# Altium project SE-HV00-02.PrjPcb
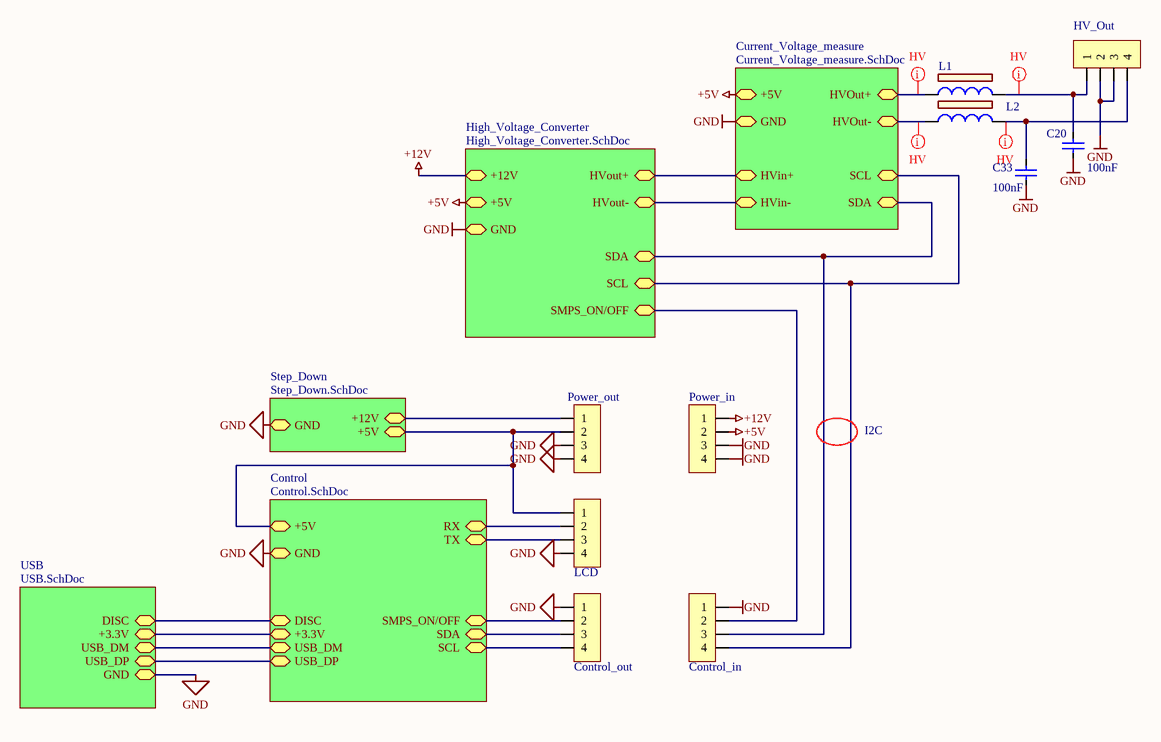
[diagram p0: SE-HV00-02.SchDoc]
6 sheets, 131 parts. Net scope: hierarchical (ports join the sheet entries above them; power ports are global).
Board file: SE-HV00-02.PcbDoc
Sheets:
  SE-HV00-02.SchDoc
    Step_Down = Step_Down.SchDoc
    High_Voltage_Converter = High_Voltage_Converter.SchDoc
    USB = USB.SchDoc
    Control = Control.SchDoc
    Current_Voltage_measure = Current_Voltage_measure.SchDoc

## Sheet SE-HV00-02.SchDoc
size A4

### Parts
C20  100nF  [C1808]
C33  100nF  [C1808]
Control_in  4 Pin Socket  [RA Socket 4 pin]  (value not drawn)
Control_out  HDR 4 Pin  [RA HDR 4Pin]  (value not drawn)
HV_Out  HDR 4  [HDR1X4_3M96V]  (value not drawn)
L1  (no value)  [LL0805\2P]
L2  (no value)  [LL0805\2P]
LCD  B4B-XH-A  [B4B-XH-A]  (value not drawn)
Power_in  4 Pin Socket  [RA Socket 4 pin]  (value not drawn)
Power_out  HDR 4 Pin  [RA HDR 4Pin]  (value not drawn)

### Sub-sheets
Control = Control.SchDoc: +5V, GND, USB_DM, USB_DP, RX, TX, SDA, SCL, DISC, SMPS_ON/OFF, +3.3V
Current_Voltage_measure = Current_Voltage_measure.SchDoc: HVin+, HVin-, SDA, SCL, +5V, GND, HVOut+, HVOut-
High_Voltage_Converter = High_Voltage_Converter.SchDoc: +12V, GND, HVout+, HVout-, SDA, SCL, SMPS_ON/OFF, +5V
Step_Down = Step_Down.SchDoc: +12V, GND, +5V
USB = USB.SchDoc: USB_DP, USB_DM, DISC, +3.3V, GND

### Nets
+3.3V: sheet USB/+3.3V, sheet Control/+3.3V
+5V: Power_in.2 ; sheet High_Voltage_Converter/+5V, sheet Current_Voltage_measure/+5V
+12V: Power_in.1 ; sheet High_Voltage_Converter/+12V
GND: C20.1 C33.1 Control_in.1 Control_out.1 HV_Out.2 HV_Out.3 LCD.4 Power_in.3 Power_in.4 Power_out.3 Power_out.4 ; sheet Step_Down/GND, sheet High_Voltage_Converter/GND, sheet USB/GND, sheet Control/GND, sheet Current_Voltage_measure/GND
NetC9_2: LCD.1 Power_out.2 ; sheet Step_Down/+5V, sheet Control/+5V
NetC12_2: Power_out.1 ; sheet Step_Down/+12V
NetC20_2: C20.2 HV_Out.1 L1.2
NetC33_2: C33.2 HV_Out.4 L2.2
NetC51_2: L1.1 ; sheet Current_Voltage_measure/HVOut+
NetC52_2: L2.1 ; sheet Current_Voltage_measure/HVOut-
NetControl_in_2: Control_in.2 ; sheet High_Voltage_Converter/SMPS_ON/OFF
NetControl_in_3: Control_in.3 ; sheet High_Voltage_Converter/SDA, sheet Current_Voltage_measure/SDA
NetControl_in_4: Control_in.4 ; sheet High_Voltage_Converter/SCL, sheet Current_Voltage_measure/SCL
NetControl_out_2: Control_out.2 ; sheet Control/SMPS_ON/OFF
NetControl_out_3: Control_out.3 ; sheet Control/SDA
NetControl_out_4: Control_out.4 ; sheet Control/SCL
NetD8_2: sheet High_Voltage_Converter/HVout+, sheet Current_Voltage_measure/HVin+
NetD9_1: sheet High_Voltage_Converter/HVout-, sheet Current_Voltage_measure/HVin-
NetLCD_2: LCD.2 ; sheet Control/RX
NetLCD_3: LCD.3 ; sheet Control/TX
NetQ2_1: sheet USB/DISC, sheet Control/DISC
NetR21_2: sheet USB/USB_DM, sheet Control/USB_DM
NetR22_2: sheet USB/USB_DP, sheet Control/USB_DP

### Layout directives
net class HV: NetC20_2, NetC33_2, NetC51_2, NetC52_2

### Notes on the sheet
- I2C

### Library data of the parts
C20 C33 = C0000111: MLCC, X7R, 100NF, 630V, 1808; Manufacturer: KEMET; Manufacturer Part Number: C1808V104KBRACTU; Voltage: 630; Tolerance: ± 10%; Part Number: C0000111; Part Type: MLCC; Material: X7R; Package: C1808; SMD: Yes; Supplier 1: Farnell; Supplier 2: Mouser; Supplier Part Number 2: 2085209; ComponentLink1Description: MFG link
Control_in Power_in = Right angle socket conn 2.54, single row: Right angle socket conn 2.54mm single row
Control_out Power_out = Right angle haeder 2.54 mm single row
HV_Out = J0000151: CONNECTOR, 4 way , HEADER, THT, 3.96MM,10A,250Vac; Manufacturer: JST; Manufacturer Part Number: B4P-VH(LF)(SN); Gender: Male; Project: RALIS; Note: S; Manufacturer Code: *; Notes: *; Aproved: -; Part Number: J0000151; Part Type: Connector\Wire to Board; Pitch: 3.96MM; SMD: No; Supplier 1: Farnell; Supplier Part Number 1: 9492020; Supplier 2: Digi-Key; Supplier Part Number 2: 455-1641-ND; ComponentLink1Description: MFG link; ComponentLink1URL: http://www.jst-mfg.com/product/detail_e.php?series=262; Data: 2014-12-15
L1 L2 = L0000002: BEAD SMD EMI FERRITE 0805 220 OHM; Manufacturer: Murata; Manufacturer Part Number: BLM21PG221SN1D; Resistance: 220 OHM; Part Number: L0000002; Part Type: Ferrite\Bead; SMD: Yes; ComponentLink1Description: MFG link; ComponentLink2Description: DataSheet; Data: 2011-01-26
LCD = J0000086: Wire to Board Header, THT, 2.5MM, 4WAY; Manufacturer: JST; Manufacturer Part Number: B4B-XH-A (LF)(SN); Gender: Pin (Male); Note: S; Manufacturer Code: *; Notes: *; Aproved: -; Part Number: J0000086; Part Type: Connector\Wire to Board; Orientation: Straight PCB PTH; Pitch: 2.5mm; SMD: No; Supplier 1: Farnell; Supplier Part Number 1: 1516278; Supplier 2: Digikey; Supplier Part Number 2: 455-2249-ND; ComponentLink1Description: MFG link; ComponentLink1URL: http://www.farnell.com/datasheets/5448.pdf; Data: 2012-06-06

## Sheet Step_Down.SchDoc
size A4
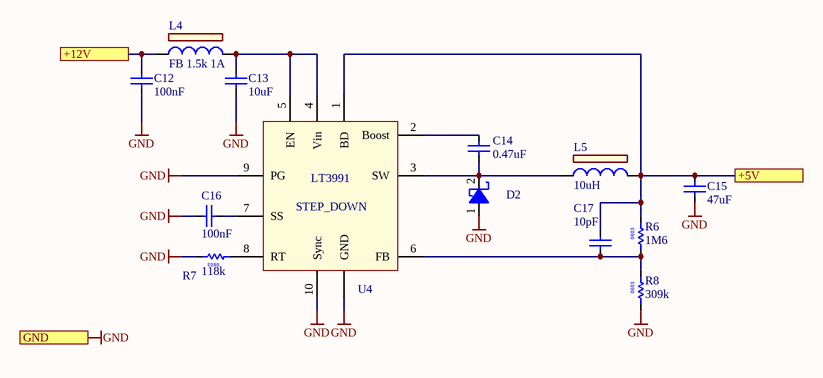
[diagram p1: Step_Down.SchDoc]

### Parts
C12  100nF  [C0603V]
C13  10uF  [CAPC3216N]
C14  0.47uF  [CAPC2012N]
C15  47uF  [CAPC2012N]
C16  100nF  [C0603V]
C17  10pF  [CAPC1608N]
D2  PMEG3010ER  [SOD123]  (value not drawn)
L4  FB 1.5k 1A  [LL0805\2P]
L5  10uH  [L1515]
R6  1M6  [RESC1608N]
R7  118k  [RESC1608X50N]
R8  309k  [RESC1608X50N]
U4  LT3991  [10-LEAD PLASTIC MSOP - duplicate]  (value not drawn)

### Ports
+5V, +12V, GND

### Nets
GND: C12.1 C13.2 C15.1 C16.1 D2.1(ANODE) R7.2 R8.1 U4.9(PG) U4.10(Sync) U4.GND ; port GND
NetC9_2: C15.2 C17.2 L5.2 R6.2 U4.1(BD) ; port +5V
NetC12_2: C12.2 L4.1 ; port +12V
NetC13_1: C13.1 L4.2 U4.4(Vin) U4.5(EN)
NetC14_1: C14.1 D2.2(CATHODE) L5.1 U4.3(SW)
NetC14_2: C14.2 U4.2(Boost)
NetC16_2: C16.2 U4.7(SS)
NetC17_1: C17.1 R6.1 R8.2 U4.6(FB)
NetR7_1: R7.1 U4.8(RT)

### Notes on the sheet
- (in symbol LT3991) STEP_DOWN
- (in symbol R0000563) 0603
- (in symbol R0000610) 0603
- (in symbol R2406149) 0603

### Library data of the parts
C12 C16 = C0000005: MLCC, 0.1uF 16V 10% X7R 0603; Manufacturer: KEMET; Manufacturer Part Number: C0603C104K4RACTU; Voltage: 16; Project: AUT-RX03-00; Note: 0,041 €; Part Number: C0000005; Part Type: MLCC; Tolerance: 10%; Material: X7R; Package: 0603 (1608 metric); SMD: Yes; Supplier 1: Farnell; Supplier Part Number 1: 1414610RL; Supplier 2: Mouser; Supplier Part Number 2: 80-C0603C104K4R; ComponentLink1Description: MFG link; ComponentLink1URL: http://www.kemet.com/datasheets&C0603C104K4RACTU; Data: 2011.02.27
C13 = C0000006: MLCC, 10uF, 16V, 10%, 1206; Manufacturer: MURATA; Manufacturer Part Number: GRM31CR71C106KAC7L; Voltage: 16; Material: X7R; Project: AUT-RX03-00; Note: 1,53 €; Part Number: C0000006; Part Type: MLCC; Tolerance: ±10%; Package: 1206 (3216 metric); SMD: Yes; Supplier 1: Farnell; Supplier Part Number 1: 1845772; Supplier 2: Mouser; Supplier Part Number 2: 81-GRM31CR71C106KAC7; ComponentLink1Description: MFG link; ComponentLink1URL: http://search.murata.co.jp/Ceramy/image/img/PDF/ENG/GRM31CR71C106KAC7.pdf; Data: 2011.02.27
C14 = C0000094: MLCC,0.47uF,50V, 0805,; Manufacturer: MURATA; Manufacturer Part Number: GRM219R60J106KE19D; Voltage: 50; Tolerance: ±10%; Material: X5R; Project: FPGA system; Note: S; Part Number: C0000094; Part Type: MLCC; Package: 0805 (2012 metric); SMD: Yes; Supplier 1: Farnell; Supplier Part Number 1: 1845738; ComponentLink1Description: MFG link; Data: 2013.04.12
C15 = C0000094: MLCC,47uF,50V, 0805,; Manufacturer: MURATA; Manufacturer Part Number: GRM219R60J106KE19D; Voltage: 50; Tolerance: ±10%; Material: X5R; Project: FPGA system; Note: S; Part Number: C0000094; Part Type: MLCC; Package: 0805 (2012 metric); SMD: Yes; Supplier 1: Farnell; Supplier Part Number 1: 1845738; ComponentLink1Description: MFG link; Data: 2013.04.12
C17 = C0000042: MLCC, 0603, NP0, 50V, 10PF; Manufacturer: MULTICOMP; Manufacturer Part Number: MCCA000192; Voltage: 100; Material: C0G / NP0; Project: Zhilinskas_I/II/III; Part Number: C0000042; Part Type: MLCC; Package: 0603 (1608 metric); SMD: Yes; Supplier 1: Farnell; Supplier Part Number 1: 1759053; Price: 0,02; MOQ: 100; Supplier 2: Mouser; Supplier Part Number 2: 77-VJ0603A100JXACBC; ComponentLink1Description: MFG link; ComponentLink1URL: http://www.farnell.com/datasheets/654515.pdf; Data: 2011.06.12
D2 = D0000058: 1A, 30V; Manufacturer: NXP; Vforvard: 360mV; Capacitance: 170pF; Part Number: D0000058; Part Type: Diode\Schottky; Reverse Voltage: 30V; Current: 1A; SMD: Yes; Manufacturer Part Number: PMEG3010ER; ComponentLink1Description: MFG link; ComponentLink1URL: http://www.nxp.com/documents/data_sheet/PMEG3010EP.pdf; Data: 2012.06.20; Supplier 1: SAMPLE
L4 = L0000004: BEAD FERRITE, SMD 1500OHM, 0805; Manufacturer: Wurth Elektronik; Manufacturer Part Number: 742792097; Resistance: 1500; Project: PSP500; Part Number: L0000004; Part Type: Ferrite\Bead; SMD: Yes; Supplier 1: Farnell; Supplier Part Number 1: 1635738; Supplier 2: Mouser; Supplier Part Number 2: 710-742792097; ComponentLink1Description: MFG link; ComponentLink1URL: http://katalog.we-online.de/kataloge/eisos/media/pdf/742792097.pdf; ComponentLink2Description: DataSheet; Data: 2011.02.01
L5 = L0000071: INDUCTOR, SMD, 4X4MM, 10UH, 20%; Manufacturer: Murata; Manufacturer Part Number: LQH44PN100MP0L; Resistance: 0.16; Current: 1.17; SRF: 25MHz; Part Number: L0000071; Part Type: Inductor\Power; Isat: 1.17; Tolerance: 20%; SMD: Yes; Supplier 1: Farnell; Supplier Part Number 1: 1782801; ComponentLink1Description: MFG link; ComponentLink2Description: DataSheet; Data: 2012.01.12
R6 = R2406149: 1M6 5% 0603 1/10W; R2408042: R2406149; Part type: Carbon Film; Tolerance: ±5%; Power: 1/10W; Package: 0603 (1608 metric); SMD: Yes; Data: 2011.01.31
R7 = R0000563: Res, 118K, 0603 (1608 metric), ±1%, 100mW, 75V; Manufacturer: PANASONIC; Manufacturer Part Number: ERJ3EKF1183V; R2408042: R0000563; Part type: Thick Film; Tolerance: ±1%; Power: 100mW; Package: 0603 (1608 metric); SMD: Yes; Supplier 1: Farnell; ComponentLink1Description: MFG link; ComponentLink1URL: http://www.farnell.com/datasheets/1678782.pdf; Data: 2015.09.15
R8 = R0000610: Res, 309K, 0603 (1608 metric), ±1%, 100mW, 75V; Manufacturer: PANASONIC; Manufacturer Part Number: ERJ3EKF3093V; R2408042: R0000610; Part type: Thick Film; Tolerance: ±1%; Power: 100mW; Package: 0603 (1608 metric); SMD: Yes; Supplier 1: Farnell; ComponentLink1Description: MFG link; ComponentLink1URL: http://www.farnell.com/datasheets/1678782.pdf; Data: 2015.09.15
U4 = LT3991: 55V, 1.2A Step-Down  Regulator with 2.8µA  Quiescent Current; Supplier 1: Newark; Supplier Part Number 1: 24T2758

## Sheet High_Voltage_Converter.SchDoc
size A4
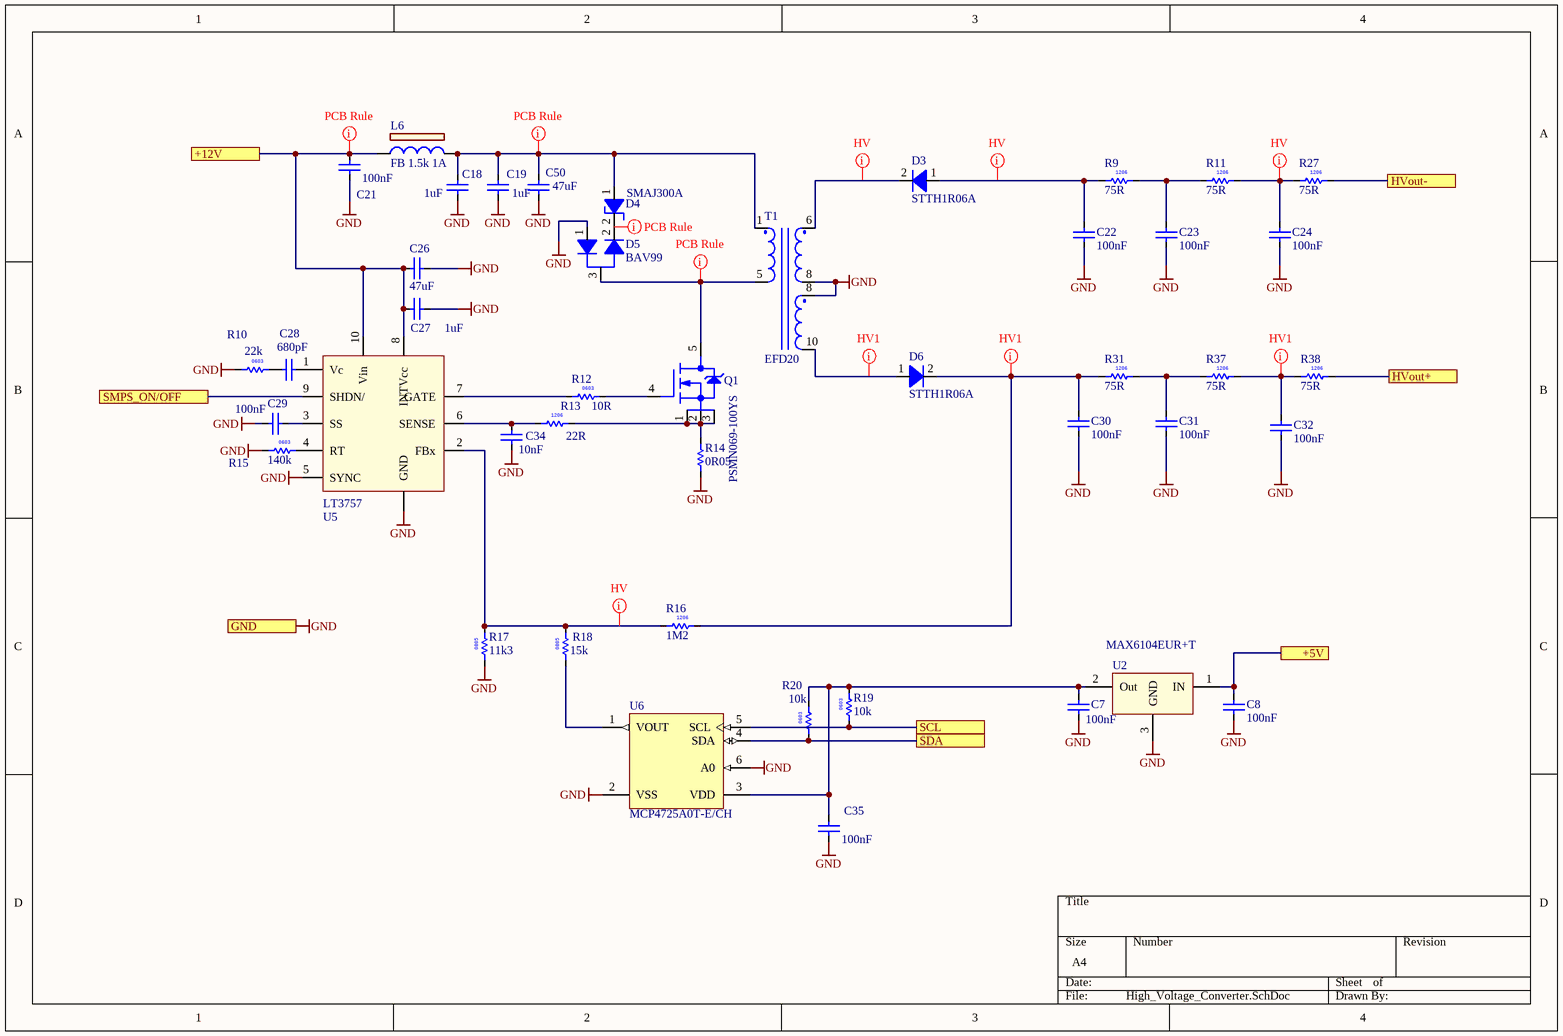
[diagram p2: High_Voltage_Converter.SchDoc]

### Parts
C7  100nF  [C0603V]
C8  100nF  [C0603V]
C18  1uF  [CAPC2012N]
C19  1uF  [CAPC2012N]
C21  100nF  [C0603V]
C22  100nF  [C1808]
C23  100nF  [C1808]
C24  100nF  [C1808]
C26  47uF  [CAPC3225N]
C27  1uF  [CAPC2012N]
C28  680pF  [CAPC3216N]
C29  100nF  [C0603V]
C30  100nF  [C1808]
C31  100nF  [C1808]
C32  100nF  [C1808]
C34  10nF  [CAPC3216N]
C35  100nF  [C0603V]
C50  47uF  [CAPC3225N]
D3  STTH1R06A  [DO-214AC]
D4  SMAJ300A  [DO-214AC]
D5  BAV99  [SOT95P240-3L]
D6  STTH1R06A  [DO-214AC]
L6  FB 1.5k 1A  [LL0805\2P]
Q1  PSMN069-100YS  [SOT669]
R9  75R  [RESC3216N]
R10  22k  [RESC1608X50N]
R11  75R  [RESC3216N]
R12  10R  [RESC1608N]
R13  22R  [RESC3216N]
R14  0R05  [RESC6432AN]
R15  140k  [RESC1608X50N]
R16  1M2  [RESC3216N]
R17  11k3  [RESC2012N]
R18  15k  [RESC2012N]
R19  10k  [RESC1608N]
R20  10k  [RESC1608N]
R27  75R  [RESC3216N]
R31  75R  [RESC3216N]
R37  75R  [RESC3216N]
R38  75R  [RESC3216N]
T1  EFD20  [EFD_20]
U2  MAX6104EUR+T  [SOT23-3]
U5  LT3757  [10-LEAD PLASTIC MSOP - duplicate]
U6  MCP4725A0T-E/CH  [SOT-23-CH6_N]

### Ports
+5V, +12V, GND, HVout+, HVout-, SCL, SDA, SMPS_ON/OFF

### Nets
+5V: C8.2 U2.1(IN) ; port +5V
+12V: C21.2 C26.1 C27.1 L6.1 U5.8(INTVcc) U5.10(Vin) ; port +12V
GND: C7.1 C8.1 C18.2 C19.2 C21.1 C22.1 C23.1 C24.1 C26.2 C27.2 C29.2 C30.1 C31.1 C32.1 C34.1 C35.1 C50.1 D5.1(A1) R10.1 R14.1 R15.1 R17.1 T1.8 U2.3(GND) U5.5(SYNC) U5.GND U6.2(VSS) U6.6(A0) ; port GND
NetC7_2: C7.2 C35.2 R19.2 R20.2 U2.2(Out) U6.3(VDD)
NetC18_1: C18.1 C19.1 C50.2 D4.1(ANODE) L6.2 T1.1
NetC22_2: C22.2 D3.1(anode) R9.1
NetC23_2: C23.2 R9.2 R11.1
NetC24_2: C24.2 R11.2 R27.1
NetC28_1: C28.1 R10.2
NetC28_2: C28.2 U5.1(Vc)
NetC29_1: C29.1 U5.3(SS)
NetC30_2: C30.2 D6.2(cathode) R16.2 R31.1
NetC31_2: C31.2 R31.2 R37.1
NetC32_2: C32.2 R37.2 R38.1
NetC34_2: C34.2 R13.1 U5.6(SENSE)
NetControl_in_2: U5.9(SHDN/) ; port SMPS_ON/OFF
NetControl_in_3: R20.1 U6.4(SDA) ; port SDA
NetControl_in_4: R19.1 U6.5(SCL) ; port SCL
NetD3_2: D3.2(cathode) T1.6
NetD4_2: D4.2(CATHODE) D5.2(A)
NetD5_3: D5.3(K) Q1.5(D) T1.5
NetD6_1: D6.1(anode) T1.10
NetD8_2: R38.2 ; port HVout+
NetD9_1: R27.2 ; port HVout-
NetQ1_1: Q1.1(S) Q1.2(S) Q1.3(S) R13.2 R14.2
NetQ1_4: Q1.4(G) R12.2
NetR12_1: R12.1 U5.7(GATE)
NetR15_2: R15.2 U5.4(RT)
NetR16_1: R16.1 R17.2 R18.2 U5.2(FBx)
NetR18_1: R18.1 U6.1(VOUT)

### Layout directives
net class HV: NetC22_2, NetC24_2, NetD3_2
net class HV1: NetC30_2, NetC32_2, NetD6_1
rule Clearance Constraint [Clearance = 0.5mm]; rule Width Constraint [Pref Width = 2mm    Min Width = 0.5mm    Max Width = 2mm]: +12V, NetC18_1, NetD4_2, NetD5_3
net class HV; rule Clearance Constraint [Clearance = 0.5mm]: NetR16_1

### Notes on the sheet
- (in symbol R0000001) 0603
- (in symbol R0000008) 0603
- (in symbol R0000022) 1206
- (in symbol R0000478) 0603
- (in symbol R0000571) 0603
- (in symbol R2408097) 0805
- (in symbol R2412032) 1206
- (in symbol R2412045) 1206

### Library data of the parts
C7 C8 C21 C29 C35 = C0000005: as C12 on sheet Step_Down; Part Number: C0000005; Part Type: MLCC; Tolerance: 10%; Material: X7R; Package: 0603 (1608 metric); SMD: Yes; Supplier 1: Farnell; Supplier Part Number 1: 1414610RL; Supplier 2: Mouser; Supplier Part Number 2: 80-C0603C104K4R; ComponentLink1Description: MFG link; ComponentLink1URL: http://www.kemet.com/datasheets&C0603C104K4RACTU; Data: 2011.02.27
C18 C19 C27 = C0000037: MLCC, 0805, X5R, 16V, 1UF; Manufacturer: MULTICOMP; Manufacturer Part Number: MCCA000596; Voltage: 16; Tolerance: ±10%; Project: Zhilinskas_I/II/III; Part Number: C0000037; Part Type: MLCC; Material: X5R; Package: 0805 (2012 metric); SMD: Yes; Supplier 1: Farnell; Supplier Part Number 1: 1759479; Price: 0,033; MOQ: 1; Supplier 2: Mouser; Supplier Part Number 2: 77-VJ0805V105ZXJCBC; ComponentLink1Description: MFG link; ComponentLink1URL: http://www.farnell.com/datasheets/462001.pdf; Data: 2011.05.05
C22-C24 C30-C32 = C0000111: as C20 on sheet SE-HV00-02; Part Number: C0000111; Part Type: MLCC; Material: X7R; Package: C1808; SMD: Yes; Supplier 1: Farnell; Supplier 2: Mouser; Supplier Part Number 2: 2085209; ComponentLink1Description: MFG link
C26 C50 = C0000077: MLCC, 1210, 47uF, 16V; Manufacturer: MURATA; Manufacturer Part Number: GRM32ER61C476ME15L; Voltage: 16; Tolerance: ±20%; Material: X5R; Part Number: C0000077; Part Type: MLCC; Package: 1210 (3225 metric); SMD: Yes; Supplier 1: Farnell; Supplier Part Number 1: 1735538; ComponentLink1Description: MFG link; ComponentLink1URL: http://www.farnell.com/datasheets/415303.pdf; Qty: 0; Data: 2012-01-20
C28 = C0000056: MLCC, 680PF, 630V, C0G/NP0, 1206; Manufacturer: MULTICOMP; Manufacturer Part Number: MC1206N681J631CT; Voltage: 630; Tolerance: ±5%; Part Number: C0000056; Part Type: MLCC; Material: C0G / NP0; Package: 1206 (3216 metric); SMD: Yes; Supplier 1: Farnell; Supplier Part Number 1: 1875399; ComponentLink1Description: MFG link; Qty: 5; Data: 2011.07.27
C34 = C0000012: MLCC, 10nF, 630V, ±10% ,X7R, 1206; Manufacturer: TDK; Manufacturer Part Number: C3216X7R2J103M; Voltage: 630; Project: AUT-RX03-00; Note: 0,182 €; Part Number: C0000012; Part Type: MLCC; Tolerance: ±10%; Material: X7R; Package: 1206 (3216 metric); SMD: Yes; Supplier 2: Mouser; Supplier Part Number 2: 810-C3216X7R2J103M; ComponentLink1Description: MFG link; ComponentLink1URL: http://www.tdk.co.jp/tefe02/e413_c.pdf; Data: 2011.02.28
D3 D6 = D0000024: DIODE, fast, 1A, 600V, SMD, SMA; Manufacturer: ST Microelectronics; Vforvard: 1V; Capacitance: 12pF; Part Number: D0000024; Part Type: Diode\Rectifier; Reverse Voltage: 600V; Current: 1A; SMD: Yes; Manufacturer Part Number: STTH1R06A; ComponentLink1Description: MFG link; ComponentLink1URL: http://www.st.com/internet/com/TECHNICAL_RESOURCES/TECHNICAL_LITERATURE/DATASHEET/CD00005135.pdf; ComponentLink2Description: DataSheet; Qty: 5; Data: 2011.06.30; Supplier 1: Farnell; Supplier Part Number 1: 1697520
D4 = D0000021: TVS DIODE, 400W, 300V, DO-214AC; Manufacturer: LITTELFUSE; Part Number: D0000021; Part Type: Diode\TVS\Unidir; Vforvard: 300V; Rating: 400W; SMD: Yes; Manufacturer Part Number: SMAJ300A; ComponentLink1Description: MFG link; ComponentLink1URL: http://www.littelfuse.com/data/en/Data_Sheets/Littelfuse_TVS-Diode_SMAJ.pdf; ComponentLink2Description: DataSheet; Qty: 5; Data: 2011.07.15; Supplier 1: Farnell; Supplier Part Number 1: 1677461; Supplier 2: Mouser; Supplier Part Number 2: 576-SMAJ300A
D5 = D0000001: DIODE SW DUAL 75V 350mW SOT23; Manufacturer Part Number: BAV99-7-F; Vforvard: 1.25V; Current: 2A; Project: AUT-RX03-00; Note: 0,289 €; Part Number: D0000001; Part Type: Diode\Small signal; Reverse Voltage: 75V; Rating: 350mW; SMD: Yes; ComponentLink1Description: MFG link; ComponentLink1URL: http://www.onsemi.com/pub_link/Collateral/BAV99LT1-D.PDF; ComponentLink2Description: DataSheet; Qty: 6000; Data: 2011.02.27; Supplier 1: Farnell; Supplier Part Number 1: 1843683; Supplier 2: Mouser; Supplier Part Number 2: 621-BAV99-F
L6 = L0000004: as L4 on sheet Step_Down; Part Number: L0000004; Part Type: Ferrite\Bead; SMD: Yes; Supplier 1: Farnell; Supplier Part Number 1: 1635738; Supplier 2: Mouser; Supplier Part Number 2: 710-742792097; ComponentLink1Description: MFG link; ComponentLink1URL: http://katalog.we-online.de/kataloge/eisos/media/pdf/742792097.pdf; ComponentLink2Description: DataSheet; Data: 2011.02.01
Q1 = Q0000050: MOSFET 100V, 72.4 mOhm standard level, LFPAK; Manufacturer: NXP; RdsON: 130mΩ; Id: 17A; InputCapacitance: 645pF; Part Number: Q0000050; Part Type: MOSFET\N-CH; Vds: 100V; SMD: Yes; Manufacturer Part Number: PSMN069-100YS; Supplier 1: Farnell; Supplier Part Number 1: 1845662RL; ComponentLink1Description: MFG link; ComponentLink1URL: http://www.nxp.com/documents/data_sheet/PSMN069-100YS.pdf; ComponentLink2Description: Datasheet MFG; Qty: 10; Data: 2012.03.26
R9 R11 R27 R31 R37 R38 = R2412045: 75R 5% 1206 1/4W; R2408042: R2412045; Part type: Carbon Film; Tolerance: ±5%; Power: 1/4W; Package: 1206 (3216 metric); SMD: Yes; Data: 2011-01-31
R10 = R0000478: Res, 22K, 0603 (1608 metric), ±1%, 100mW, 75V; Manufacturer: PANASONIC; Manufacturer Part Number: ERJ3EKF2202V; R2408042: R0000478; Part type: Thick Film; Tolerance: ±1%; Power: 100mW; Package: 0603 (1608 metric); SMD: Yes; Supplier 1: Farnell; ComponentLink1Description: MFG link; ComponentLink1URL: http://www.farnell.com/datasheets/1678782.pdf; Data: 2015.09.15
R12 = R0000001: Res, 0603 0.1W 5%; Manufacturer: PANASONIC; Manufacturer Part Number: ERJ-3GEYJ100V; R2408042: R0000001; Part type: Thick Film; Tolerance: ±5%; Power: 0.1W; Package: 0603 (1608 metric); SMD: Yes; Supplier 1: Farnell; Supplier Part Number 1: 2059548; Supplier 2: Mouser; Supplier Part Number 2: 667-ERJ-3GEYJ100V; ComponentLink1Description: Datasheet MFG; ComponentLink1URL: http://www.panasonic.com/industrial/components/pdf/AOA0000CE1.pdf; Data: 2011.02.27
R13 = R2412032: 22R 5% 1206 1/4W; R2408042: R2412032; Part type: Carbon Film; Tolerance: ±5%; Power: 1/4W; Package: 1206 (3216 metric); SMD: Yes; Data: 2011.01.31
R14 = R2412183: Res, 0.05R 1% 2512 1W; Manufacturer: WELWYN; Manufacturer Part Number: LR2512-R05FW; Note: S; R2408042: R2412183; Part type: Thick Film; Tolerance: ±1%; Power: 1W; Package: 2512 (6431 metric); SMD: Yes; Supplier 1: Farnell; Supplier Part Number 1: 1100065; ComponentLink1Description: MFG link; Qty: 5; Data: 2011.09.22
R15 = R0000571: Res, 140K, 0603 (1608 metric), ±1%, 100mW, 75V; Manufacturer: PANASONIC; Manufacturer Part Number: ERJ3EKF1403V; R2408042: R0000571; Part type: Thick Film; Tolerance: ±1%; Power: 100mW; Package: 0603 (1608 metric); SMD: Yes; Supplier 1: Farnell; ComponentLink1Description: MFG link; ComponentLink1URL: http://www.farnell.com/datasheets/1678782.pdf; Data: 2015.09.15
R16 = R0000022: Res, 1M 0.25W, 1% 1206; Manufacturer: Bourns; Manufacturer Part Number: CR1206-FX-1004ELF; Project: AUT-RX03-00; Note: 0,041 €; R2408042: R0000022; Part type: Thick Film; Tolerance: ±1%; Power: 0.25W; Package: 1206 (3216 metric); SMD: Yes; Supplier 2: Mouser; Supplier Part Number 2: 652-CR1206FX-1004ELF; ComponentLink1Description: Datasheet MFG; ComponentLink1URL: http://www.bourns.com/data/global/pdfs/CHPREZTR.pdf; Data: 2011.03.05
R17 R18 = R2408097: Res, 11K 5% 0805 1/8W; R2408042: R2408097; Part type: Carbon Film; Tolerance: ±5%; Power: 1/8W; Package: 0805 (2012 metric); SMD: Yes; Data: 2011.01.31
R19 R20 = R0000008: Res, 10K 0.063W 75V 1%  0603; Manufacturer: MULTICOMP; Manufacturer Part Number: MCMR06X1002FTL; Project: AUT-RX03-00; Note: 0,033 €; R2408042: R0000008; Part type: Thick Film; Tolerance: ±1%; Power: 0.063W; Package: 0603 (1608 metric); SMD: Yes; Supplier 1: Farnell; Supplier Part Number 1: 2073349; Supplier 2: Mouser; Supplier Part Number 2: 594-MCT06030C1002FP5; ComponentLink1Description: Datasheet MFG; ComponentLink1URL: http://www.vishay.com/doc?28705; Data: 2011.02.28
T1 = EFD_20: Supplier 1: Newark; Supplier Part Number 1: 06W0667
U2 = MAX6104EUR+T: Low-Cost, Micropower, Low-Dropout,  High-Output-Current, SOT23 Voltage References; Supplier 1: Farnell; Supplier Part Number 1: 2511340
U5 = LT3757: Boost, Flyback, SEPIC and  Inverting Controller; Supplier 1: Farnell; Supplier Part Number 1: 2294952
U6 = MCP4725A0T-E/CH: 12-Bit Digital-to-Analog Converter with EEPROM Memory in SOT-23-6, 6-Pin SOT-23, Extended Temperature, Tape and Reel; Published: 29-Jan-2009; LatestRevisionDate: 02-Dec-2009; LatestRevisionNote: Updated to datasheet revision D, Jun-2009; DatasheetVersion: revD, Jun-2009; PackageVersion: revBB, Aug-2009; PackageReference: SOT-23-CH6; Publisher: Altium Limited; PackageDescription: 6-Lead Plastic Small Outline Transistor (CH) [SOT-23]; Supplier 1: Digi-Key; Supplier Part Number 1: MCP4725A0T-E/CHTR-ND; Supplier 2: Digi-Key; Supplier Part Number 2: MCP4725A0T-E/CHCT-ND; Supplier 3: Digi-Key; Supplier Part Number 3: MCP4725A0T-E/CHDKR-ND; Supplier 4: Farnell; Supplier Part Number 4: 1578449; Code_IPC: SOT26A-6; ComponentLink1Description: Datasheet; ComponentLink1URL: http://ww1.microchip.com/downloads/en/DeviceDoc/22039d.pdf; ComponentLink2Description: Packaging Specification; ComponentLink2URL: http://www.microchip.com/stellent/groups/techpub_sg/documents/packagingspec/en012702.pdf; ComponentLink3Description: Microchip.com Home; ComponentLink3URL: http://www.microchip.com/

## Sheet USB.SchDoc
size A4
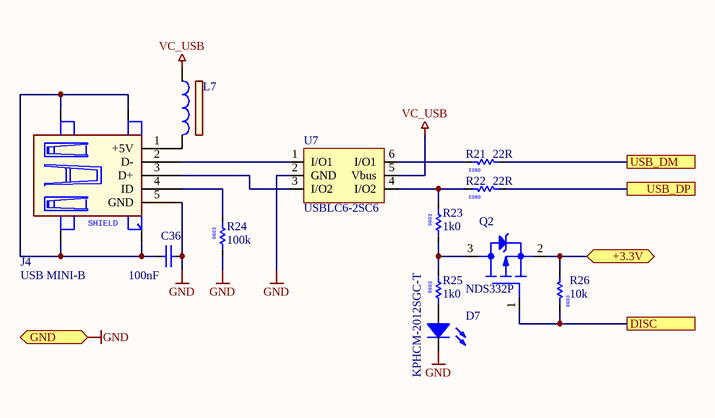
[diagram p3: USB.SchDoc]

### Parts
C36  100nF  [C0603V]
D7  KPHCM-2012SGC-T  [D0805]
J4  USB MINI-B  [MOLEX_MINI_USB-B]
L7  (no value)  [LL0805\2P]
Q2  NDS332P  [SOT23-3L]
R21  22R  [RESC1608N]
R22  22R  [RESC1608N]
R23  1k0  [RESC1608N]
R24  100k  [RESC1608N]
R25  1k0  [RESC1608N]
R26  10k  [RESC1608N]
U7  USBLC6-2SC6  [SOT95P280X145-6N]

### Ports
+3.3V, DISC, GND, USB_DM, USB_DP

### Nets
+3.3V: Q2.2(S) R26.2 ; port +3.3V
GND: C36.1 D7.2 J4.5(GND) R24.1 U7.2(GND) ; port GND
VC_USB: L7.1 U7.5(Vbus)
NetC36_2: C36.2 J4.6(SHIELD) J4.7(SHIELD) J4.8(SHIELD) J4.9(SHIELD)
NetD7_1: D7.1 R25.1
NetJ4_1: J4.1(+5V) L7.2
NetJ4_2: J4.2(D-) U7.1(I/O1)
NetJ4_3: J4.3(D+) U7.3(I/O2)
NetJ4_4: J4.4(ID) R24.2
NetQ2_1: Q2.1(G) R26.1 ; port DISC
NetQ2_3: Q2.3(D) R23.1 R25.2
NetR21_1: R21.1 U7.6(I/O1)
NetR21_2: R21.2 ; port USB_DM
NetR22_1: R22.1 R23.2 U7.4(I/O2)
NetR22_2: R22.2 ; port USB_DP

### Notes on the sheet
- (in symbol R0000006) 0603
- (in symbol R0000008) 0603
- (in symbol R2406032) 0603
- (in symbol R2406120) 0603

### Library data of the parts
C36 = C0000005: as C12 on sheet Step_Down; Part Number: C0000005; Part Type: MLCC; Tolerance: 10%; Material: X7R; Package: 0603 (1608 metric); SMD: Yes; Supplier 1: Farnell; Supplier Part Number 1: 1414610RL; Supplier 2: Mouser; Supplier Part Number 2: 80-C0603C104K4R; ComponentLink1Description: MFG link; ComponentLink1URL: http://www.kemet.com/datasheets&C0603C104K4RACTU; Data: 2011.02.27
D7 = D0000030: LED, SMD, 0805, GREEN, 25mcd; Manufacturer: KINGBRIGHT; Vforvard: 2.5; Current: 20mA; Project: Zhilinskas_I/II/III; Note: S; Part Number: D0000030; Part Type: Diode\LED; Rating: 25 mcd; SMD: Yes; Manufacturer Part Number: KPHCM-2012SGC-T; ComponentLink1Description: MFG link; ComponentLink1URL: http://www.kingbright-europe.de/_daten/KPHCM-2012SGC-T(Ver.3).pdf; ComponentLink2Description: DataSheet; Data: 2011.09.15; Supplier 1: Farnell; Supplier Part Number 1: 1686074; Supplier 2: Mouser; Supplier Part Number 2: 859-LTST-C171CKT
J4 = J0000002: USB MINI-B SMT connector; Manufacturer: Molex; Manufacturer Part Number: 675031020; Gender: Receptacle; 3D Model: SW3dPS-USB_mini_B; Project: PSP500; Part Number: J0000002; Part Type: Connector\USB; Orientation: RA; SMD: Yes; Supplier 1: Farnell; Supplier Part Number 1: 1125348; Price: 5,39; Supplier 2: Mouser; Supplier Part Number 2: 538-67503-1020; ComponentLink1Description: MFG link; ComponentLink1URL: http://www.molex.com/pdm_docs/sd/675031020_sd.pdf; ComponentLink2Description: USB.pdf; ComponentLink2URL: \\193.219.36.50\nescafe\Altium Database\KTU340DB\PDF\Connector\USB\675031020_sd.pdf; Qty: 5; Data: 2011.01.28
L7 = L0000002: as L1 on sheet SE-HV00-02; Part Number: L0000002; Part Type: Ferrite\Bead; SMD: Yes; ComponentLink1Description: MFG link; ComponentLink2Description: DataSheet; Data: 2011-01-26
Q2 = Q0000046: P-Channel Logic Level Enhancement Mode Field Effect Transistor; Manufacturer: FAIRCHILD SEMICONDUCTOR; Vds: -20V; RdsON: 300mΩ; Id: 1A; Part Number: Q0000046; Part Type: MOSFET\P-CH; SMD: Yes; Manufacturer Part Number: NDS332P; Supplier 1: Farnell; Supplier Part Number 1: 1471069; Supplier 2: Mouser; Supplier Part Number 2: 512-NDS332P; ComponentLink1Description: MFG link; ComponentLink1URL: http://www.fairchildsemi.com/ds/ND/NDS332P.pdf; ComponentLink2Description: Datasheet MFG; Qty: 3; Data: 2012.02.20
R21 R22 = R2406032: Res, 22R 5% 0603 1/10W; Manufacturer: MULTICOMP; Manufacturer Part Number: MC0063W0603122R; Supplier 1: Farnell; Supplier Part Number 1: 9330844; Supplier 2: Mouser; Supplier Part Number 2: 660-RK73H1JTTD22R0F; Part type: Carbon Film; Tolerance: ±5%; Power: 1/10W; Package: 0603 (1608 metric); SMD: Yes; Data: 2011.01.31; R2408042: R2406032
R23 R25 = R0000006: Res, thin film 1k  ±5% 0.1W 0603; Manufacturer: MULTICOMP; Manufacturer Part Number: MCMR06X102 JTL; Project: AUT-RX03-00; Note: 0,083 €; R2408042: R0000006; Part type: Thin Film; Tolerance: ±5%; Power: 0.1W; Package: 0603 (1608 metric); SMD: Yes; Supplier 1: Farnell; Supplier Part Number 1: 2073354; Supplier 2: Mouser; Supplier Part Number 2: 71-TNPW06031K00DEEA; ComponentLink1Description: Datasheet MFG; ComponentLink1URL: http://www.vishay.com./doc?28758; Data: 2011.02.28
R24 = R2406120: Res, 100K 5% 0603 1/10W; Manufacturer: YAGEO; Manufacturer Part Number: RC0603FR-13100KL; Tolerance: ±1%; R2408042: R2406120; Part type: Carbon Film; Power: 1/10W; Package: 0603 (1608 metric); SMD: Yes; Supplier 1: Farnell; Supplier Part Number 1: 2309107; Supplier 2: Mouser; Supplier Part Number 2: 603-RC0603FR-13100KL; Data: 2011.01.31
R26 = R0000008: as R19 on sheet High_Voltage_Converter; R2408042: R0000008; Part type: Thick Film; Tolerance: ±1%; Power: 0.063W; Package: 0603 (1608 metric); SMD: Yes; Supplier 1: Farnell; Supplier Part Number 1: 2073349; Supplier 2: Mouser; Supplier Part Number 2: 594-MCT06030C1002FP5; ComponentLink1Description: Datasheet MFG; ComponentLink1URL: http://www.vishay.com/doc?28705; Data: 2011.02.28
U7 = D0000115: DIODE ARRAY, TVS, USB2; Manufacturer: STMICROELECTRONICS; Part Number: D0000115; Part Type: Diode\TVS; SMD: Yes; Manufacturer Part Number: USBLC6-2SC6; ComponentLink1Description: MFG link; ComponentLink1URL: http://www.farnell.com/datasheets/1690354.pdf; Data: 2016.03.08; Supplier 1: Farnell; Supplier Part Number 1: 1269406

## Sheet Control.SchDoc
size A4
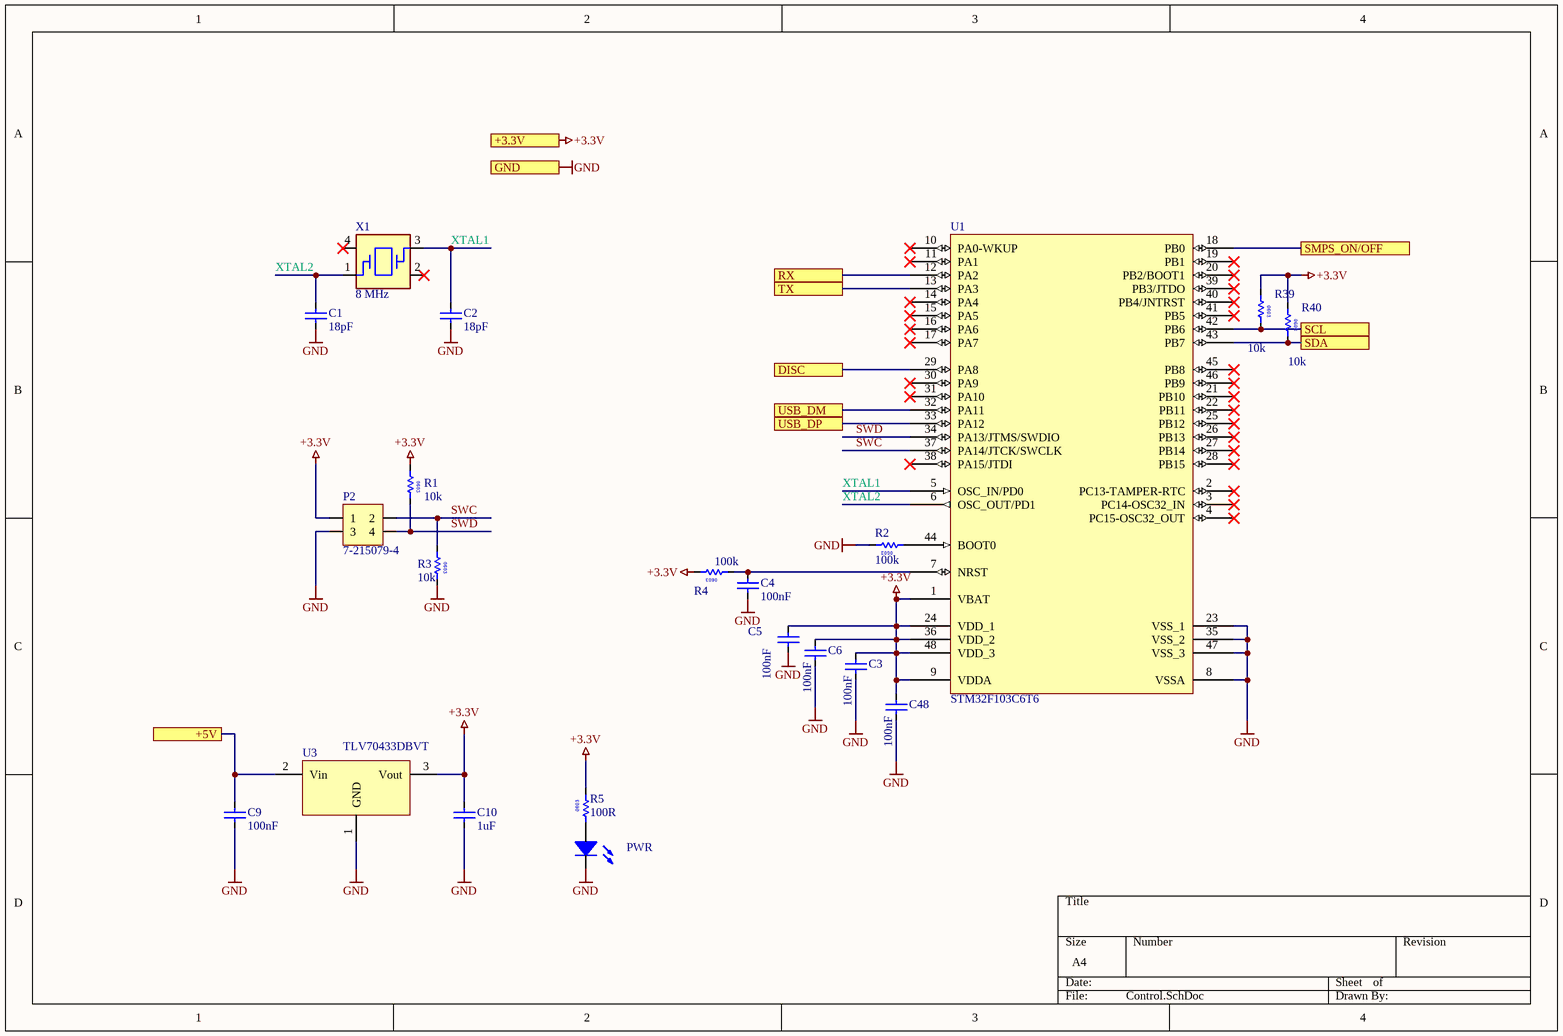
[diagram p4: Control.SchDoc]

### Parts
C1  18pF  [CAPC1608N]
C2  18pF  [CAPC1608N]
C3  100nF  [C0603V]
C4  100nF  [C0603V]
C5  100nF  [C0603V]
C6  100nF  [C0603V]
C9  100nF  [C0603V]
C10  1uF  [CAPC2012N]
C48  100nF  [C0603V]
P2  7-215079-4  [ZIP-T4]
PWR  KPHCM-2012SGC-T  [D0805]  (value not drawn)
R1  10k  [RESC1608N]
R2  100k  [RESC1608N]
R3  10k  [RESC1608N]
R4  100k  [RESC1608N]
R5  100R  [RESC1608N]
R39  10k  [RESC1608N]
R40  10k  [RESC1608N]
U1  STM32F103C6T6  [LQFP48_N]
U3  TLV70433DBVT  [SO-G5/P.95]
X1  8 MHz  [2SMX-3SMXB]

### Ports
+3.3V, +5V, DISC, GND, RX, SCL, SDA, SMPS_ON/OFF, TX, USB_DM, USB_DP

### Nets
+3.3V: C3.2 C5.2 C6.2 C10.2 C48.2 P2.1 R1.1 R4.2 R5.2 R39.1 R40.1 U1.1(VBAT) U1.9(VDDA) U1.24(VDD_1) U1.36(VDD_2) U1.48(VDD_3) U3.3(Vout) ; port +3.3V
GND: C1.1 C2.1 C3.1 C4.1 C5.1 C6.1 C9.1 C10.1 C48.1 P2.3 PWR.2 R2.2 R3.2 U1.8(VSSA) U1.23(VSS_1) U1.35(VSS_2) U1.47(VSS_3) U3.1(GND) ; port GND
SWC: P2.2 R3.1 U1.37(PA14/JTCK/SWCLK)
SWD: P2.4 R1.2 U1.34(PA13/JTMS/SWDIO)
XTAL1: C2.2 U1.5(OSC_IN/PD0) X1.3
XTAL2: C1.2 U1.6(OSC_OUT/PD1) X1.1
NetC4_2: C4.2 R4.1 U1.7(NRST)
NetC9_2: C9.2 U3.2(Vin) ; port +5V
NetControl_out_2: U1.18(PB0) ; port SMPS_ON/OFF
NetControl_out_3: R40.2 U1.43(PB7) ; port SDA
NetControl_out_4: R39.2 U1.42(PB6) ; port SCL
NetLCD_2: U1.12(PA2) ; port RX
NetLCD_3: U1.13(PA3) ; port TX
NetPWR_1: PWR.1 R5.1
NetQ2_1: U1.29(PA8) ; port DISC
NetR2_1: R2.1 U1.44(BOOT0)
NetR21_2: U1.32(PA11) ; port USB_DM
NetR22_2: U1.33(PA12) ; port USB_DP

Not connected (* = marked no-connect by the designer): U1 2(PC13-TAMPER-RTC)* 3(PC14-OSC32_IN)* 4(PC15-OSC32_OUT)* 10(PA0-WKUP)* 11(PA1)* 14(PA4)* 15(PA5)* 16(PA6)* 17(PA7)* 19(PB1)* 20(PB2/BOOT1)* 21(PB10)* 22(PB11)* 25(PB12)* 26(PB13)* 27(PB14)* 28(PB15)* 30(PA9)* 31(PA10)* 38(PA15/JTDI)* 39(PB3/JTDO)* 40(PB4/JNTRST)* 41(PB5)* 45(PB8)* 46(PB9)*; X1 2* 4*

### Notes on the sheet
- (in symbol R0000008) 0603
- (in symbol R2406048) 0603
- (in symbol R2406120) 0603

### Library data of the parts
C1 C2 = C0000124: MLCC, 18 pF, ± 5%, C0G / NP0, 50 V, 0603; Manufacturer: MULTICOMP; Manufacturer Part Number: MC0603N180J500CT; Voltage: 50; Part Number: C0000124; Part Type: MLCC; Tolerance: ±5%; Material: C0G / NP0; Package: 0603 (1608 metric); SMD: Yes; Supplier 1: Farnell; Supplier Part Number 1: 1759056; ComponentLink1Description: MFG link; ComponentLink1URL: http://www.farnell.com/datasheets/1901289.pdf; Data: 2016.03.08
C3-C6 C9 C48 = C0000005: as C12 on sheet Step_Down; Part Number: C0000005; Part Type: MLCC; Tolerance: 10%; Material: X7R; Package: 0603 (1608 metric); SMD: Yes; Supplier 1: Farnell; Supplier Part Number 1: 1414610RL; Supplier 2: Mouser; Supplier Part Number 2: 80-C0603C104K4R; ComponentLink1Description: MFG link; ComponentLink1URL: http://www.kemet.com/datasheets&C0603C104K4RACTU; Data: 2011.02.27
C10 = C0000037: as C18 on sheet High_Voltage_Converter; Part Number: C0000037; Part Type: MLCC; Material: X5R; Package: 0805 (2012 metric); SMD: Yes; Supplier 1: Farnell; Supplier Part Number 1: 1759479; Price: 0,033; MOQ: 1; Supplier 2: Mouser; Supplier Part Number 2: 77-VJ0805V105ZXJCBC; ComponentLink1Description: MFG link; ComponentLink1URL: http://www.farnell.com/datasheets/462001.pdf; Data: 2011.05.05
P2 = J0000107: Micro-match SOCKET, TOP ENTRY, 4WAY PTH, 1.27mm; Manufacturer: TE Connectivity; Gender: Female; Note: S; Manufacturer Code: *; Notes: *; Aproved: -; Part Number: J0000107; Part Type: Connector\MiniHeader; Orientation: Straight; Pitch: 1.27mm; SMD: No; Manufacturer Part Number: 7-215079-4; Supplier 1: Farnell; Supplier Part Number 1: 148507; ComponentLink1Description: MFG link; ComponentLink1URL: http://www.tycoelectronics.com/commerce/DocumentDelivery/DDEController?Action=srchrtrv&DocNm=108-19052&DocType=Specification+Or+Standard&DocLang=English; Data: 2012.12.18
PWR = D0000030: as D7 on sheet USB; Part Number: D0000030; Part Type: Diode\LED; Rating: 25 mcd; SMD: Yes; Manufacturer Part Number: KPHCM-2012SGC-T; ComponentLink1Description: MFG link; ComponentLink1URL: http://www.kingbright-europe.de/_daten/KPHCM-2012SGC-T(Ver.3).pdf; ComponentLink2Description: DataSheet; Data: 2011.09.15; Supplier 1: Farnell; Supplier Part Number 1: 1686074; Supplier 2: Mouser; Supplier Part Number 2: 859-LTST-C171CKT
R1 R3 R39 R40 = R0000008: as R19 on sheet High_Voltage_Converter; R2408042: R0000008; Part type: Thick Film; Tolerance: ±1%; Power: 0.063W; Package: 0603 (1608 metric); SMD: Yes; Supplier 1: Farnell; Supplier Part Number 1: 2073349; Supplier 2: Mouser; Supplier Part Number 2: 594-MCT06030C1002FP5; ComponentLink1Description: Datasheet MFG; ComponentLink1URL: http://www.vishay.com/doc?28705; Data: 2011.02.28
R2 R4 = R2406120: as R24 on sheet USB; R2408042: R2406120; Part type: Carbon Film; Power: 1/10W; Package: 0603 (1608 metric); SMD: Yes; Supplier 1: Farnell; Supplier Part Number 1: 2309107; Supplier 2: Mouser; Supplier Part Number 2: 603-RC0603FR-13100KL; Data: 2011.01.31
R5 = R2406048: Res, 100R 5% 0603 1/10W; Manufacturer: MULTICOMP; Manufacturer Part Number: MC 0.063W 0603 5% 100R; R2408042: R2406048; Part type: MC 0.063W 0603 5% 100R; Tolerance: ±5%; Power: 1/10W; Package: 0603 (1608 metric); SMD: Yes; Supplier 1: Farnell; Supplier Part Number 1: 9331689RL; Data: 2011.01.31
U1 = STM32F103C6T6: STM32 ARM-based 32-bit MCU with 32 Kbytes Flash, 48-pin LQFP, Industrial Temperature; Published: 30-May-2008; DatasheetVersion: rev6, Mar-2008; PackageVersion: Mar-2008; PackageReference: LQFP48; Publisher: Altium Limited; PackageDescription: 48-Pin Low-Profile Quad Flat Pack, 7 x 7 mm Body, 0.5 mm Pitch (LQFP48); ComponentLink1Description: Manufacturer Link; ComponentLink1URL: www.st.com/stm32; ComponentLink2Description: Datasheet; ComponentLink2URL: http://www.st.com/stonline/products/literature/ds/13587.pdf
U3 = U0000415: LDO, 3.3V, 150MA, SOT23-5 Vin - 24V; Manufacturer: Texas Instruments; LibRef: U0000415; SMD: Yes; Manufacturer Part Number: TLV70433DBVT; Supplier 1: Farnell; Supplier Part Number 1: 2075417; ComponentLink1Description: Datasheet MFG; ComponentLink1URL: http://www.farnell.com/datasheets/1634139.pdf; ComponentLink2Description: Manufacturer Page; Data: 2012.07.31
X1 = M0000014: CRYSTAL, 8M, 18PF CL, 6X3.6MM SMT; Manufacturer: ABRACON; Manufacturer Part Number: ABMM2-8.000MHZ-E2-T; Rating: 8MHz; Tolerance: ± 20ppm; Note: 1; Part Number: M0000014; Part Type: Crystals\XTAL; SMD: Yes; Supplier 1: Farnell; Supplier Part Number 1: 1611803; Price: 2,57; MOQ: 1; Supplier 2: Mouser; Supplier Part Number 2: 815-ABMM2-8-E2T; ComponentLink1Description: MFG link; ComponentLink2Description: Datasheet PDF; ComponentLink2URL: http://www.abracon.com/Resonators/ABMM2.pdf; Qty: 7; Data: 2011.02.17

## Sheet Current_Voltage_measure.SchDoc
size 381 x 241 mm
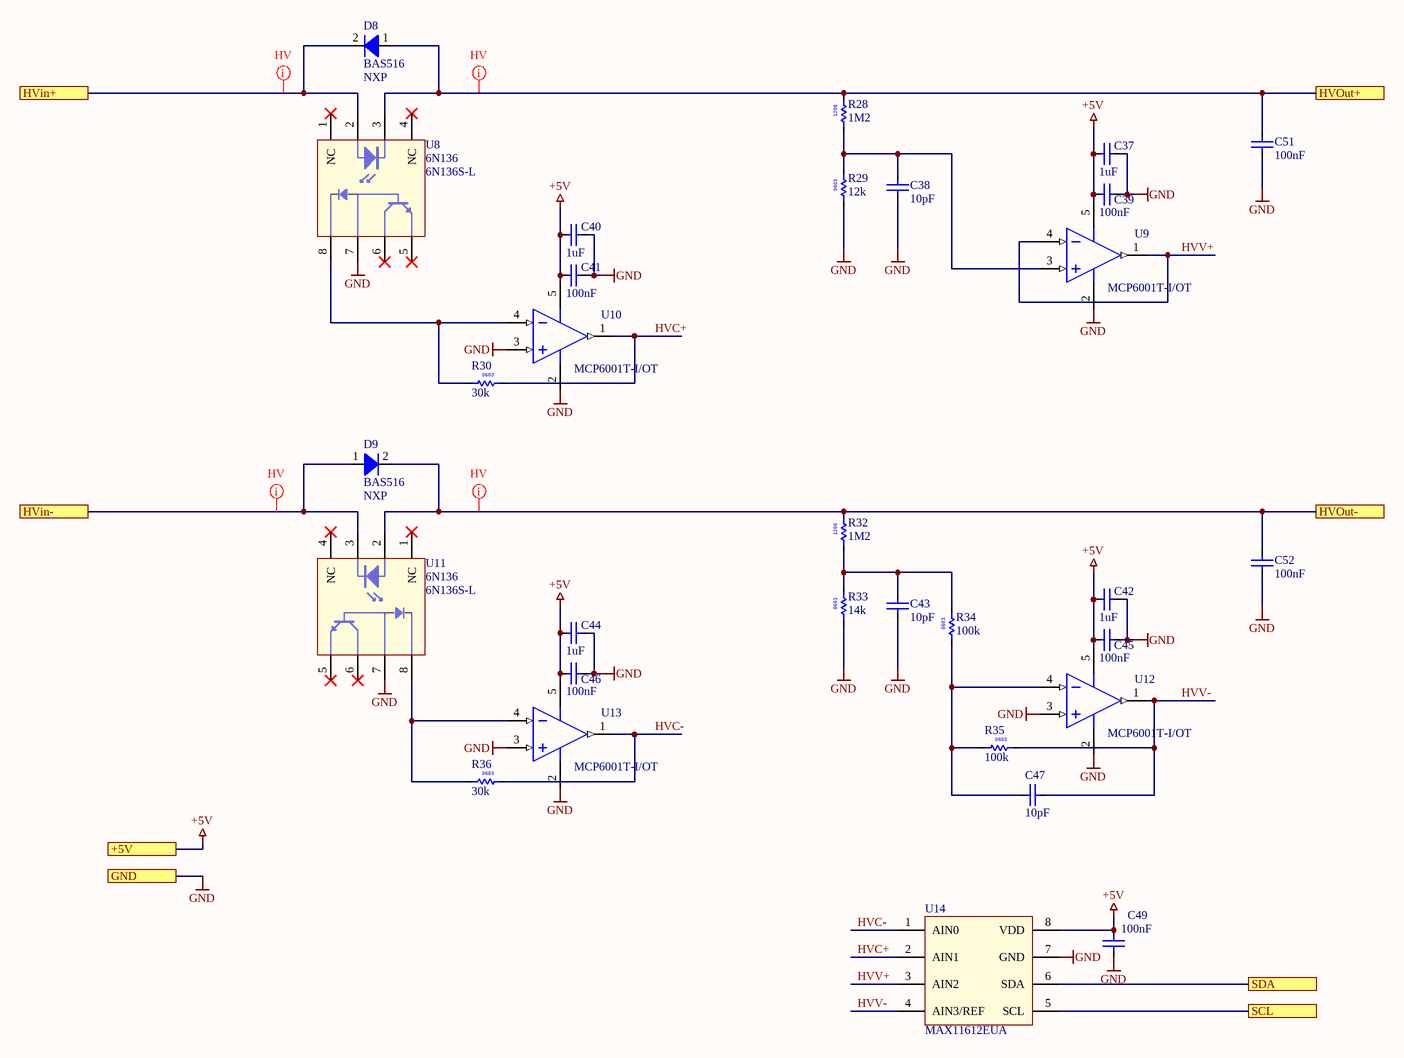
[diagram p5: Current_Voltage_measure.SchDoc]

### Parts
C37  1uF  [CAPC2012N]
C38  10pF  [CAPC1608N]
C39  100nF  [C0603V]
C40  1uF  [CAPC2012N]
C41  100nF  [C0603V]
C42  1uF  [CAPC2012N]
C43  10pF  [CAPC1608N]
C44  1uF  [CAPC2012N]
C45  100nF  [C0603V]
C46  100nF  [C0603V]
C47  10pF  [CAPC1608N]
C49  100nF  [C0603V]
C51  100nF  [C1808]
C52  100nF  [C1808]
D8  BAS516  Manufacturer: NXP  [SOD523]
D9  BAS516  Manufacturer: NXP  [SOD523]
R28  1M2  [RESC3216N]
R29  12k  [RESC1608X50N]
R30  30k  [RESC1608N]
R32  1M2  [RESC3216N]
R33  14k  [RESC1608X50N]
R34  100k  [RESC1608X50N]
R35  100k  [RESC1608X50N]
R36  30k  [RESC1608N]
U8  6N136  Supplier Part Number 1: 6N136S-L  [SMP-8]
U9  MCP6001T-I/OT  [SO-G5/X.45]
U10  MCP6001T-I/OT  [SO-G5/X.45]
U11  6N136  Supplier Part Number 1: 6N136S-L  [SMP-8]
U12  MCP6001T-I/OT  [SO-G5/X.45]
U13  MCP6001T-I/OT  [SO-G5/X.45]
U14  MAX11612EUA  [uMAX-8]

### Ports
+5V, GND, HVin+, HVin-, HVOut+, HVOut-, SCL, SDA

### Nets
+5V: C37.1 C39.2 C40.1 C41.2 C42.1 C44.1 C45.2 C46.2 C49.1 U9.5(V+) U10.5(V+) U12.5(V+) U13.5(V+) U14.8(VDD) ; port +5V
GND: C37.2 C38.1 C39.1 C40.2 C41.1 C42.2 C43.1 C44.2 C45.1 C46.1 C49.2 C51.1 C52.1 R29.1 R33.1 U8.7(Vb) U9.2(V-) U10.2(V-) U10.3(IN+) U11.7(Vb) U12.2(V-) U12.3(IN+) U13.2(V-) U13.3(IN+) U14.7(GND) ; port GND
HVC+: R30.2 U10.1(OUT) U14.2(AIN1)
HVC-: R36.2 U13.1(OUT) U14.1(AIN0)
HVV+: U9.1(OUT) U9.4(IN-) U14.3(AIN2)
HVV-: C47.1 R35.2 U12.1(OUT) U14.4(AIN3/REF)
NetC38_2: C38.2 R28.1 R29.2 U9.3(IN+)
NetC43_2: C43.2 R32.1 R33.2 R34.2
NetC47_2: C47.2 R34.1 R35.1 U12.4(IN-)
NetC51_2: C51.2 D8.1(anode) R28.2 U8.3(C) ; port HVOut+
NetC52_2: C52.2 D9.2(cathode) R32.2 U11.2(A) ; port HVOut-
NetControl_in_3: U14.6(SDA) ; port SDA
NetControl_in_4: U14.5(SCL) ; port SCL
NetD8_2: D8.2(cathode) U8.2(A) ; port HVin+
NetD9_1: D9.1(anode) U11.3(C) ; port HVin-
NetR30_1: R30.1 U8.8(Vcc) U10.4(IN-)
NetR36_1: R36.1 U11.8(Vcc) U13.4(IN-)

Not connected (* = marked no-connect by the designer): U8 1(NC)* 4(NC)* 5(GND)* 6(Vo)*; U11 1(NC)* 4(NC)* 5(GND)* 6(Vo)*

### Layout directives
net class HV: NetC51_2, NetC52_2, NetD8_2, NetD9_1

### Notes on the sheet
- (in symbol R0000022) 1206
- (in symbol R0000450) 0603
- (in symbol R0000457) 0603
- (in symbol R0000556) 0603
- (in symbol R2406107) 0603

### Library data of the parts
C37 C40 C42 C44 = C0000037: MLCC, 0805, X5R, 16V, 1uF; Manufacturer: MULTICOMP; Manufacturer Part Number: MCCA000596; Voltage: 16; Tolerance: ±10%; Project: Zhilinskas_I/II/III; Part Number: C0000037; Part Type: MLCC; Material: X5R; Package: 0805 (2012 metric); SMD: Yes; Supplier 1: Farnell; Supplier Part Number 1: 1759479; Price: 0.033; MOQ: 1; Supplier 2: Mouser; Supplier Part Number 2: 77-VJ0805V105ZXJCBC; ComponentLink1Description: MFG link; ComponentLink1URL: http://www.farnell.com/datasheets/462001.pdf; Data: 2011-05-05
C38 C43 C47 = C0000042: as C17 on sheet Step_Down; Part Number: C0000042; Part Type: MLCC; Package: 0603 (1608 metric); SMD: Yes; Supplier 1: Farnell; Supplier Part Number 1: 1759053; Price: 0.02; MOQ: 100; Supplier 2: Mouser; Supplier Part Number 2: 77-VJ0603A100JXACBC; ComponentLink1Description: MFG link; ComponentLink1URL: http://www.farnell.com/datasheets/654515.pdf; Data: 2011-06-12
C39 C41 C45 C46 C49 = C0000005: as C12 on sheet Step_Down; Part Number: C0000005; Part Type: MLCC; Tolerance: 10%; Material: X7R; Package: 0603 (1608 metric); SMD: Yes; Supplier 1: Farnell; Supplier Part Number 1: 1414610RL; Supplier 2: Mouser; Supplier Part Number 2: 80-C0603C104K4R; ComponentLink1Description: MFG link; ComponentLink1URL: http://www.kemet.com/datasheets&C0603C104K4RACTU; Data: 2011.02.27
C51 C52 = C0000111: as C20 on sheet SE-HV00-02; Part Number: C0000111; Part Type: MLCC; Material: X7R; Package: C1808; SMD: Yes; Supplier 1: Farnell; Supplier 2: Mouser; Supplier Part Number 2: 2085209; ComponentLink1Description: MFG link
D8 D9 = D0000081: DIODE, SWITCHING, SOD-523; Vforvard: 1V; Reverse Voltage: 75V; Current: 250mA; Capacitance: 1pF; Part Number: D0000081; Part Type: Diode\Small signal; SMD: Yes; Manufacturer Part Number: BAS516; ComponentLink1Description: MFG link; ComponentLink1URL: http://www.farnell.com/datasheets/1499213.pdf; Data: 2013-01-11; Supplier 1: Farnell; Supplier Part Number 1: 8734402
R28 R32 = R0000022: as R16 on sheet High_Voltage_Converter; R2408042: R0000022; Part type: Thick Film; Tolerance: ±1%; Power: 0.25W; Package: 1206 (3216 metric); SMD: Yes; Supplier 2: Mouser; Supplier Part Number 2: 652-CR1206FX-1004ELF; ComponentLink1Description: Datasheet MFG; ComponentLink1URL: http://www.bourns.com/data/global/pdfs/CHPREZTR.pdf; Data: 2011.03.05
R29 = R0000450: Res, 12K, 0603 (1608 metric), ±1%, 100mW, 75V; Manufacturer: PANASONIC; Manufacturer Part Number: ERJ3EKF1202V; R2408042: R0000450; Part type: Thick Film; Tolerance: ±1%; Power: 100mW; Package: 0603 (1608 metric); SMD: Yes; Supplier 1: Farnell; ComponentLink1Description: MFG link; ComponentLink1URL: http://www.farnell.com/datasheets/1678782.pdf; Data: 2015-09-15
R30 R36 = R2406107: 30K 5% 0603 1/10W; R2408042: R2406107; Part type: Carbon Film; Tolerance: ±5%; Power: 1/10W; Package: 0603 (1608 metric); SMD: Yes; Data: 2011-01-31
R33 = R0000457: Res, 14K, 0603 (1608 metric), ±1%, 100mW, 75V; Manufacturer: PANASONIC; Manufacturer Part Number: ERJ3EKF1402V; R2408042: R0000457; Part type: Thick Film; Tolerance: ±1%; Power: 100mW; Package: 0603 (1608 metric); SMD: Yes; Supplier 1: Farnell; ComponentLink1Description: MFG link; ComponentLink1URL: http://www.farnell.com/datasheets/1678782.pdf; Data: 2015-09-15
R34 R35 = R0000556: Res, 100K, 0603 (1608 metric), ±1%, 100mW, 75V; Manufacturer: PANASONIC; Manufacturer Part Number: ERJ3EKF1003V; R2408042: R0000556; Part type: Thick Film; Tolerance: ±1%; Power: 100mW; Package: 0603 (1608 metric); SMD: Yes; Supplier 1: Farnell; ComponentLink1Description: MFG link; ComponentLink1URL: http://www.farnell.com/datasheets/1678782.pdf; Data: 2015-09-15
U8 U11 = 6N136: 6N136.SDM  Optocoupler, Transistor Output, 1 Channel, Surface Mount DIP, 8 Pins, 50 mA, 5 kV, 19 %; Supplier 1: TME
U9 U10 U12 U13 = MCP6001T-I/OT: MICROCHIP  MCP6001T-I/OT  Operational Amplifier, Single, 1 Amplifier, 1 MHz, 0.6 V/µs, 1.8V to 6V, SOT-23, 5 Pins; Supplier 1: Farnell; Supplier Part Number 1: 4974992
U14 = MAX11612EUA: MAXIM INTEGRATED PRODUCTS  MAX11612EUA+  Analogue to Digital Converter, Low Power, 12 bit, 94.4 kSPS, Single, 4.5 V, 5.5 V, µMAX; Supplier 1: Farnell; Supplier Part Number 1: 2513417

## Nets that join several sheets
+3.3V: USB (Q2.2 R26.2), Control (17 pins)
+5V: SE-HV00-02 (Power_in.2), High_Voltage_Converter (C8.2 U2.1), Current_Voltage_measure (14 pins)
+12V: SE-HV00-02 (Power_in.1), High_Voltage_Converter (6 pins)
GND: SE-HV00-02 (11 pins), Step_Down (10 pins), High_Voltage_Converter (28 pins), USB (5 pins), Control (18 pins), Current_Voltage_measure (25 pins)
NetC9_2: SE-HV00-02 (LCD.1 Power_out.2), Step_Down (5 pins), Control (C9.2 U3.2)
NetC12_2: SE-HV00-02 (Power_out.1), Step_Down (C12.2 L4.1)
NetC51_2: SE-HV00-02 (L1.1), Current_Voltage_measure (C51.2 D8.1 R28.2 U8.3)
NetC52_2: SE-HV00-02 (L2.1), Current_Voltage_measure (C52.2 D9.2 R32.2 U11.2)
NetControl_in_2: SE-HV00-02 (Control_in.2), High_Voltage_Converter (U5.9)
NetControl_in_3: SE-HV00-02 (Control_in.3), High_Voltage_Converter (R20.1 U6.4), Current_Voltage_measure (U14.6)
NetControl_in_4: SE-HV00-02 (Control_in.4), High_Voltage_Converter (R19.1 U6.5), Current_Voltage_measure (U14.5)
NetControl_out_2: SE-HV00-02 (Control_out.2), Control (U1.18)
NetControl_out_3: SE-HV00-02 (Control_out.3), Control (R40.2 U1.43)
NetControl_out_4: SE-HV00-02 (Control_out.4), Control (R39.2 U1.42)
NetD8_2: High_Voltage_Converter (R38.2), Current_Voltage_measure (D8.2 U8.2)
NetD9_1: High_Voltage_Converter (R27.2), Current_Voltage_measure (D9.1 U11.3)
NetLCD_2: SE-HV00-02 (LCD.2), Control (U1.12)
NetLCD_3: SE-HV00-02 (LCD.3), Control (U1.13)
NetQ2_1: USB (Q2.1 R26.1), Control (U1.29)
NetR21_2: USB (R21.2), Control (U1.32)
NetR22_2: USB (R22.2), Control (U1.33)